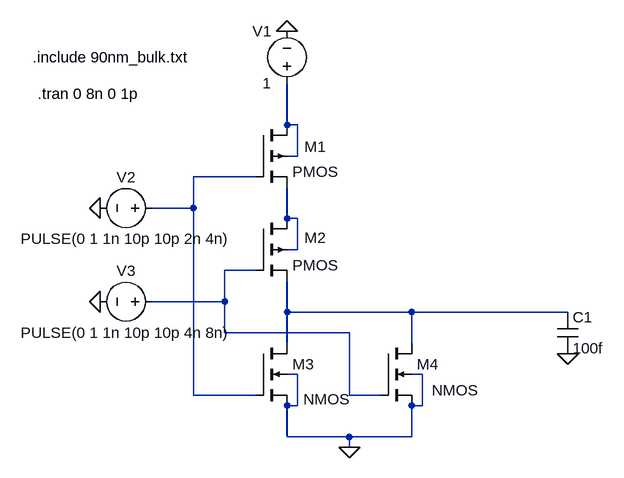
[diagram p0: schematic nand.asc]
nand.asc, the LTspice schematic file:
Version 4
SHEET 1 880 680
WIRE 112 -128 112 -192
WIRE 128 -128 112 -128
WIRE 128 -80 128 -128
WIRE 128 -80 112 -80
WIRE 64 -48 -32 -48
WIRE -32 0 -32 -48
WIRE -32 0 -96 0
WIRE 112 16 112 -32
WIRE 128 16 112 16
WIRE 128 64 128 16
WIRE 128 64 112 64
WIRE 64 96 16 96
WIRE 16 144 16 96
WIRE 16 144 -96 144
WIRE 112 160 112 112
WIRE 304 160 112 160
WIRE 544 160 304 160
WIRE 16 192 16 144
WIRE 208 192 16 192
WIRE 112 208 112 160
WIRE 304 208 304 160
WIRE 128 256 112 256
WIRE 320 256 304 256
WIRE -32 288 -32 0
WIRE 64 288 -32 288
WIRE 208 288 208 192
WIRE 256 288 208 288
WIRE 128 304 128 256
WIRE 128 304 112 304
WIRE 320 304 320 256
WIRE 320 304 304 304
WIRE 112 352 112 304
WIRE 208 352 112 352
WIRE 304 352 304 304
WIRE 304 352 208 352
WIRE 208 368 208 352
FLAG 208 368 0
FLAG 544 224 0
FLAG 112 -272 0
FLAG -176 0 0
FLAG -176 144 0
SYMBOL pmos4 64 -128 R0
WINDOW 0 75 34 Left 2
SYMATTR InstName M1
SYMATTR Value2 l=90n w=400n
SYMBOL pmos4 64 16 R0
WINDOW 0 75 30 Left 2
SYMATTR InstName M2
SYMATTR Value2 l=90n w=400n
SYMBOL nmos4 64 208 R0
WINDOW 3 73 86 Left 2
SYMATTR InstName M3
SYMATTR Value2 l=90n w=200n
SYMBOL nmos4 256 208 R0
WINDOW 3 79 72 Left 2
SYMATTR InstName M4
SYMATTR Value2 l=90n w=200n
SYMBOL voltage 112 -176 R180
WINDOW 0 24 96 Left 2
WINDOW 3 24 16 Left 2
WINDOW 123 0 0 Left 0
WINDOW 39 0 0 Left 0
SYMATTR InstName V1
SYMATTR Value 1
SYMBOL voltage -80 0 R90
WINDOW 0 -32 56 VBottom 2
WINDOW 3 32 56 VTop 2
WINDOW 123 0 0 Left 0
WINDOW 39 0 0 Left 0
SYMATTR InstName V2
SYMATTR Value PULSE(0 1 1n 10p 10p 2n 4n)
SYMBOL cap 528 160 R0
SYMATTR InstName C1
SYMATTR Value 100f
SYMBOL voltage -80 144 R90
WINDOW 0 -32 56 VBottom 2
WINDOW 3 32 56 VTop 2
WINDOW 123 0 0 Left 0
WINDOW 39 0 0 Left 0
SYMATTR InstName V3
SYMATTR Value PULSE(0 1 1n 10p 10p 4n 8n)
TEXT -280 -232 Left 2 !.include 90nm_bulk.txt
TEXT -272 -176 Left 2 !.tran 0 8n 0 1p

The netlist it stands for:
* nand.asc
M1 N001 N002 N003 N001 PMOS l=90n w=400n
M2 N003 N004 N005 N003 PMOS l=90n w=400n
M3 N005 N002 0 0 NMOS l=90n w=200n
M4 N005 N004 0 0 NMOS l=90n w=200n
V1 N001 0 1
V2 N002 0 PULSE(0 1 1n 10p 10p 2n 4n)
C1 N005 0 100f
V3 N004 0 PULSE(0 1 1n 10p 10p 4n 8n)
.model NMOS NMOS
.model PMOS PMOS
.lib standard.mos
.include 90nm_bulk.txt
.tran 0 8n 0 1p
.backanno
.end